# EAGLE design KeyboardWithArrows (EAGLE 9.3.1)
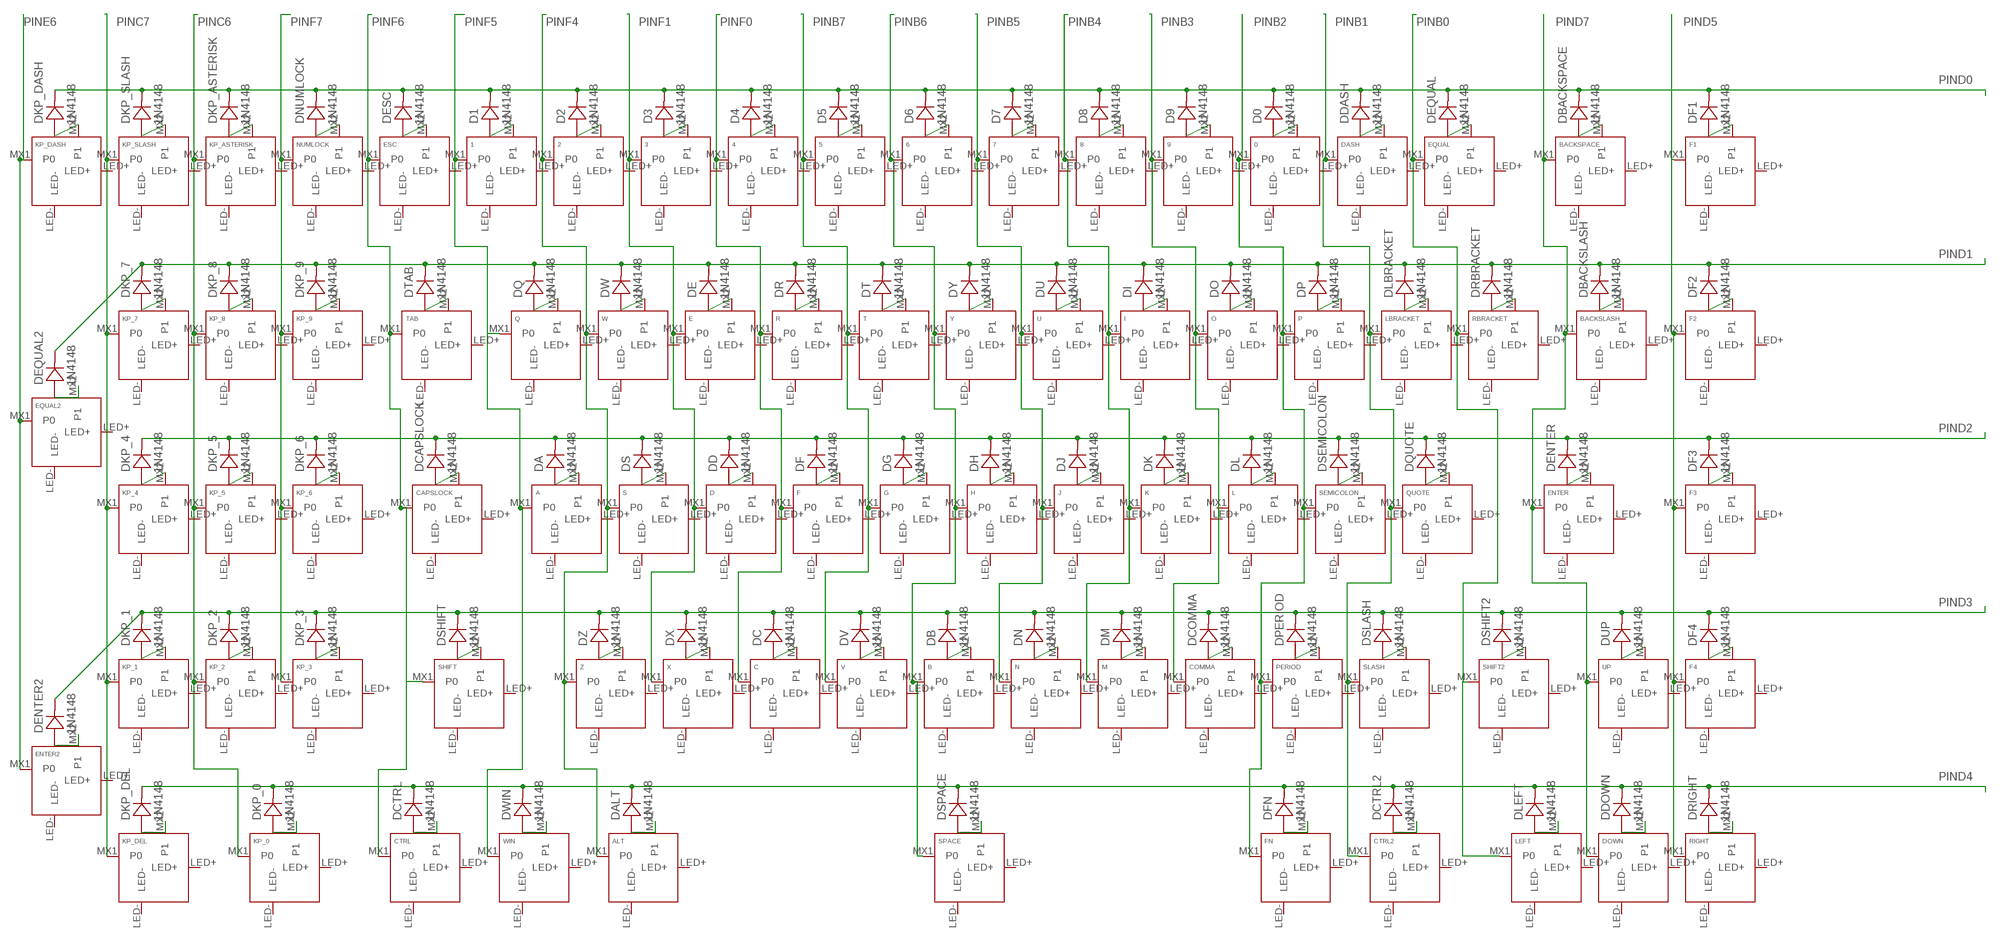
[diagram p0: schematic, sheet 1, part 1 of 2]
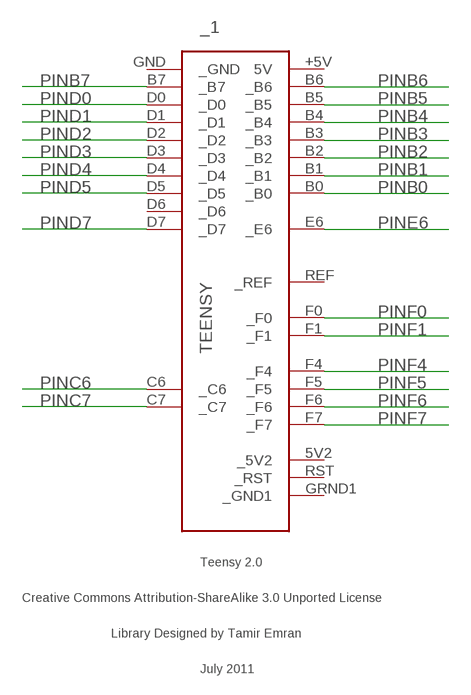
[diagram p1: schematic, sheet 1, part 2 of 2]

## Parts
0  KEYSWITCH-LED-MX-1U-LED  [MX-1U-LED]
1  KEYSWITCH-LED-MX-1U-LED  [MX-1U-LED]
2  KEYSWITCH-LED-MX-1U-LED  [MX-1U-LED]
3  KEYSWITCH-LED-MX-1U-LED  [MX-1U-LED]
4  KEYSWITCH-LED-MX-1U-LED  [MX-1U-LED]
5  KEYSWITCH-LED-MX-1U-LED  [MX-1U-LED]
6  KEYSWITCH-LED-MX-1U-LED  [MX-1U-LED]
7  KEYSWITCH-LED-MX-1U-LED  [MX-1U-LED]
8  KEYSWITCH-LED-MX-1U-LED  [MX-1U-LED]
9  KEYSWITCH-LED-MX-1U-LED  [MX-1U-LED]
_1  TEENSY  [TEENSY]
A  KEYSWITCH-LED-MX-1U-LED  [MX-1U-LED]
ALT  KEYSWITCH-LED-MX-1U-LED  [MX-1U-LED]
B  KEYSWITCH-LED-MX-1U-LED  [MX-1U-LED]
BACKSLASH  KEYSWITCH-LED-MX-1U-LED  [MX-1U-LED]
BACKSPACE  KEYSWITCH-LED-MX-2U-LED  [MX-2U-LED]
C  KEYSWITCH-LED-MX-1U-LED  [MX-1U-LED]
CAPSLOCK  KEYSWITCH-LED-MX-1U-LED  [MX-1U-LED]
COMMA  KEYSWITCH-LED-MX-1U-LED  [MX-1U-LED]
CTRL  KEYSWITCH-LED-MX-1U-LED  [MX-1U-LED]
CTRL2  KEYSWITCH-LED-MX-1U-LED  [MX-1U-LED]
D  KEYSWITCH-LED-MX-1U-LED  [MX-1U-LED]
D0  1N4148  DIODE-DO-35  [DO-35]
D1  1N4148  DIODE-DO-35  [DO-35]
D2  1N4148  DIODE-DO-35  [DO-35]
D3  1N4148  DIODE-DO-35  [DO-35]
D4  1N4148  DIODE-DO-35  [DO-35]
D5  1N4148  DIODE-DO-35  [DO-35]
D6  1N4148  DIODE-DO-35  [DO-35]
D7  1N4148  DIODE-DO-35  [DO-35]
D8  1N4148  DIODE-DO-35  [DO-35]
D9  1N4148  DIODE-DO-35  [DO-35]
DA  1N4148  DIODE-DO-35  [DO-35]
DALT  1N4148  DIODE-DO-35  [DO-35]
DASH  KEYSWITCH-LED-MX-1U-LED  [MX-1U-LED]
DB  1N4148  DIODE-DO-35  [DO-35]
DBACKSLASH  1N4148  DIODE-DO-35  [DO-35]
DBACKSPACE  1N4148  DIODE-DO-35  [DO-35]
DC  1N4148  DIODE-DO-35  [DO-35]
DCAPSLOCK  1N4148  DIODE-DO-35  [DO-35]
DCOMMA  1N4148  DIODE-DO-35  [DO-35]
DCTRL  1N4148  DIODE-DO-35  [DO-35]
DCTRL2  1N4148  DIODE-DO-35  [DO-35]
DD  1N4148  DIODE-DO-35  [DO-35]
DDASH  1N4148  DIODE-DO-35  [DO-35]
DDOWN  1N4148  DIODE-DO-35  [DO-35]
DE  1N4148  DIODE-DO-35  [DO-35]
DENTER  1N4148  DIODE-DO-35  [DO-35]
DENTER2  1N4148  DIODE-DO-35  [DO-35]
DEQUAL  1N4148  DIODE-DO-35  [DO-35]
DEQUAL2  1N4148  DIODE-DO-35  [DO-35]
DESC  1N4148  DIODE-DO-35  [DO-35]
DF  1N4148  DIODE-DO-35  [DO-35]
DF1  1N4148  DIODE-DO-35  [DO-35]
DF2  1N4148  DIODE-DO-35  [DO-35]
DF3  1N4148  DIODE-DO-35  [DO-35]
DF4  1N4148  DIODE-DO-35  [DO-35]
DFN  1N4148  DIODE-DO-35  [DO-35]
DG  1N4148  DIODE-DO-35  [DO-35]
DH  1N4148  DIODE-DO-35  [DO-35]
DI  1N4148  DIODE-DO-35  [DO-35]
DJ  1N4148  DIODE-DO-35  [DO-35]
DK  1N4148  DIODE-DO-35  [DO-35]
DKP_0  1N4148  DIODE-DO-35  [DO-35]
DKP_1  1N4148  DIODE-DO-35  [DO-35]
DKP_2  1N4148  DIODE-DO-35  [DO-35]
DKP_3  1N4148  DIODE-DO-35  [DO-35]
DKP_4  1N4148  DIODE-DO-35  [DO-35]
DKP_5  1N4148  DIODE-DO-35  [DO-35]
DKP_6  1N4148  DIODE-DO-35  [DO-35]
DKP_7  1N4148  DIODE-DO-35  [DO-35]
DKP_8  1N4148  DIODE-DO-35  [DO-35]
DKP_9  1N4148  DIODE-DO-35  [DO-35]
DKP_ASTERISK  1N4148  DIODE-DO-35  [DO-35]
DKP_DASH  1N4148  DIODE-DO-35  [DO-35]
DKP_DEL  1N4148  DIODE-DO-35  [DO-35]
DKP_SLASH  1N4148  DIODE-DO-35  [DO-35]
DL  1N4148  DIODE-DO-35  [DO-35]
DLBRACKET  1N4148  DIODE-DO-35  [DO-35]
DLEFT  1N4148  DIODE-DO-35  [DO-35]
DM  1N4148  DIODE-DO-35  [DO-35]
DN  1N4148  DIODE-DO-35  [DO-35]
DNUMLOCK  1N4148  DIODE-DO-35  [DO-35]
DO  1N4148  DIODE-DO-35  [DO-35]
DOWN  KEYSWITCH-LED-MX-1U-LED  [MX-1U-LED]
DP  1N4148  DIODE-DO-35  [DO-35]
DPERIOD  1N4148  DIODE-DO-35  [DO-35]
DQ  1N4148  DIODE-DO-35  [DO-35]
DQUOTE  1N4148  DIODE-DO-35  [DO-35]
DR  1N4148  DIODE-DO-35  [DO-35]
DRBRACKET  1N4148  DIODE-DO-35  [DO-35]
DRIGHT  1N4148  DIODE-DO-35  [DO-35]
DS  1N4148  DIODE-DO-35  [DO-35]
DSEMICOLON  1N4148  DIODE-DO-35  [DO-35]
DSHIFT  1N4148  DIODE-DO-35  [DO-35]
DSHIFT2  1N4148  DIODE-DO-35  [DO-35]
DSLASH  1N4148  DIODE-DO-35  [DO-35]
DSPACE  1N4148  DIODE-DO-35  [DO-35]
DT  1N4148  DIODE-DO-35  [DO-35]
DTAB  1N4148  DIODE-DO-35  [DO-35]
DU  1N4148  DIODE-DO-35  [DO-35]
DUP  1N4148  DIODE-DO-35  [DO-35]
DV  1N4148  DIODE-DO-35  [DO-35]
DW  1N4148  DIODE-DO-35  [DO-35]
DWIN  1N4148  DIODE-DO-35  [DO-35]
DX  1N4148  DIODE-DO-35  [DO-35]
DY  1N4148  DIODE-DO-35  [DO-35]
DZ  1N4148  DIODE-DO-35  [DO-35]
E  KEYSWITCH-LED-MX-1U-LED  [MX-1U-LED]
ENTER  KEYSWITCH-LED-MX-2U-LED  [MX-2U-LED]
ENTER2  KEYSWITCH-LED-MX-1U-LED  [MX-1U-LED]
EQUAL  KEYSWITCH-LED-MX-1U-LED  [MX-1U-LED]
EQUAL2  KEYSWITCH-LED-MX-1U-LED  [MX-1U-LED]
ESC  KEYSWITCH-LED-MX-1U-LED  [MX-1U-LED]
F  KEYSWITCH-LED-MX-1U-LED  [MX-1U-LED]
F1  KEYSWITCH-LED-MX-1U-LED  [MX-1U-LED]
F2  KEYSWITCH-LED-MX-1U-LED  [MX-1U-LED]
F3  KEYSWITCH-LED-MX-1U-LED  [MX-1U-LED]
F4  KEYSWITCH-LED-MX-1U-LED  [MX-1U-LED]
FN  KEYSWITCH-LED-MX-1U-LED  [MX-1U-LED]
G  KEYSWITCH-LED-MX-1U-LED  [MX-1U-LED]
H  KEYSWITCH-LED-MX-1U-LED  [MX-1U-LED]
I  KEYSWITCH-LED-MX-1U-LED  [MX-1U-LED]
J  KEYSWITCH-LED-MX-1U-LED  [MX-1U-LED]
K  KEYSWITCH-LED-MX-1U-LED  [MX-1U-LED]
KP_0  KEYSWITCH-LED-MX-2U-LED  [MX-2U-LED]
KP_1  KEYSWITCH-LED-MX-1U-LED  [MX-1U-LED]
KP_2  KEYSWITCH-LED-MX-1U-LED  [MX-1U-LED]
KP_3  KEYSWITCH-LED-MX-1U-LED  [MX-1U-LED]
KP_4  KEYSWITCH-LED-MX-1U-LED  [MX-1U-LED]
KP_5  KEYSWITCH-LED-MX-1U-LED  [MX-1U-LED]
KP_6  KEYSWITCH-LED-MX-1U-LED  [MX-1U-LED]
KP_7  KEYSWITCH-LED-MX-1U-LED  [MX-1U-LED]
KP_8  KEYSWITCH-LED-MX-1U-LED  [MX-1U-LED]
KP_9  KEYSWITCH-LED-MX-1U-LED  [MX-1U-LED]
KP_ASTERISK  KEYSWITCH-LED-MX-1U-LED  [MX-1U-LED]
KP_DASH  KEYSWITCH-LED-MX-1U-LED  [MX-1U-LED]
KP_DEL  KEYSWITCH-LED-MX-1U-LED  [MX-1U-LED]
KP_SLASH  KEYSWITCH-LED-MX-1U-LED  [MX-1U-LED]
L  KEYSWITCH-LED-MX-1U-LED  [MX-1U-LED]
LBRACKET  KEYSWITCH-LED-MX-1U-LED  [MX-1U-LED]
LEFT  KEYSWITCH-LED-MX-1U-LED  [MX-1U-LED]
M  KEYSWITCH-LED-MX-1U-LED  [MX-1U-LED]
N  KEYSWITCH-LED-MX-1U-LED  [MX-1U-LED]
NUMLOCK  KEYSWITCH-LED-MX-1U-LED  [MX-1U-LED]
O  KEYSWITCH-LED-MX-1U-LED  [MX-1U-LED]
P  KEYSWITCH-LED-MX-1U-LED  [MX-1U-LED]
PERIOD  KEYSWITCH-LED-MX-1U-LED  [MX-1U-LED]
Q  KEYSWITCH-LED-MX-1U-LED  [MX-1U-LED]
QUOTE  KEYSWITCH-LED-MX-1U-LED  [MX-1U-LED]
R  KEYSWITCH-LED-MX-1U-LED  [MX-1U-LED]
RBRACKET  KEYSWITCH-LED-MX-1U-LED  [MX-1U-LED]
RIGHT  KEYSWITCH-LED-MX-1U-LED  [MX-1U-LED]
S  KEYSWITCH-LED-MX-1U-LED  [MX-1U-LED]
SEMICOLON  KEYSWITCH-LED-MX-1U-LED  [MX-1U-LED]
SHIFT  KEYSWITCH-LED-MX-2U-LED  [MX-2U-LED]
SHIFT2  KEYSWITCH-LED-MX-1U-LED  [MX-1U-LED]
SLASH  KEYSWITCH-LED-MX-1U-LED  [MX-1U-LED]
SPACE  KEYSWITCH-LED-MX-6.25U-LED  [MX-6.25U-LED]
T  KEYSWITCH-LED-MX-1U-LED  [MX-1U-LED]
TAB  KEYSWITCH-LED-MX-1U-LED  [MX-1U-LED]
U  KEYSWITCH-LED-MX-1U-LED  [MX-1U-LED]
UP  KEYSWITCH-LED-MX-1U-LED  [MX-1U-LED]
V  KEYSWITCH-LED-MX-1U-LED  [MX-1U-LED]
W  KEYSWITCH-LED-MX-1U-LED  [MX-1U-LED]
WIN  KEYSWITCH-LED-MX-1U-LED  [MX-1U-LED]
X  KEYSWITCH-LED-MX-1U-LED  [MX-1U-LED]
Y  KEYSWITCH-LED-MX-1U-LED  [MX-1U-LED]
Z  KEYSWITCH-LED-MX-1U-LED  [MX-1U-LED]

## Nets
N$1: DKP_DASH.A KP_DASH.MX2(P1)
N$2: DKP_SLASH.A KP_SLASH.MX2(P1)
N$3: DKP_ASTERISK.A KP_ASTERISK.MX2(P1)
N$4: DNUMLOCK.A NUMLOCK.MX2(P1)
N$5: 1.MX2(P1) D1.A
N$6: DESC.A ESC.MX2(P1)
N$7: 2.MX2(P1) D2.A
N$8: 3.MX2(P1) D3.A
N$9: 4.MX2(P1) D4.A
N$10: 5.MX2(P1) D5.A
N$11: 6.MX2(P1) D6.A
N$12: 7.MX2(P1) D7.A
N$13: 8.MX2(P1) D8.A
N$14: 9.MX2(P1) D9.A
N$15: 0.MX2(P1) D0.A
N$16: DASH.MX2(P1) DDASH.A
N$17: DEQUAL.A EQUAL.MX2(P1)
N$18: BACKSPACE.MX2(P1) DBACKSPACE.A
N$19: DF1.A F1.MX2(P1)
N$20: DF2.A F2.MX2(P1)
N$21: BACKSLASH.MX2(P1) DBACKSLASH.A
N$22: DRBRACKET.A RBRACKET.MX2(P1)
N$23: DLBRACKET.A LBRACKET.MX2(P1)
N$24: DP.A P.MX2(P1)
N$25: DO.A O.MX2(P1)
N$26: DI.A I.MX2(P1)
N$27: DU.A U.MX2(P1)
N$28: DY.A Y.MX2(P1)
N$29: DT.A T.MX2(P1)
N$30: DR.A R.MX2(P1)
N$31: DE.A E.MX2(P1)
N$32: DW.A W.MX2(P1)
N$33: DQ.A Q.MX2(P1)
N$34: DTAB.A TAB.MX2(P1)
N$35: DKP_9.A KP_9.MX2(P1)
N$36: DKP_8.A KP_8.MX2(P1)
N$37: DKP_7.A KP_7.MX2(P1)
N$38: DKP_4.A KP_4.MX2(P1)
N$39: DKP_5.A KP_5.MX2(P1)
N$40: DKP_6.A KP_6.MX2(P1)
N$41: CAPSLOCK.MX2(P1) DCAPSLOCK.A
N$42: A.MX2(P1) DA.A
N$43: DS.A S.MX2(P1)
N$44: D.MX2(P1) DD.A
N$45: DF.A F.MX2(P1)
N$46: DG.A G.MX2(P1)
N$47: DH.A H.MX2(P1)
N$48: DJ.A J.MX2(P1)
N$49: DK.A K.MX2(P1)
N$50: DL.A L.MX2(P1)
N$51: DSEMICOLON.A SEMICOLON.MX2(P1)
N$52: DQUOTE.A QUOTE.MX2(P1)
N$53: DENTER.A ENTER.MX2(P1)
N$54: DF3.A F3.MX2(P1)
N$55: DF4.A F4.MX2(P1)
N$56: DUP.A UP.MX2(P1)
N$57: DSHIFT2.A SHIFT2.MX2(P1)
N$58: DSLASH.A SLASH.MX2(P1)
N$59: DPERIOD.A PERIOD.MX2(P1)
N$60: COMMA.MX2(P1) DCOMMA.A
N$61: DM.A M.MX2(P1)
N$62: DN.A N.MX2(P1)
N$63: B.MX2(P1) DB.A
N$64: DV.A V.MX2(P1)
N$65: C.MX2(P1) DC.A
N$66: DX.A X.MX2(P1)
N$67: DZ.A Z.MX2(P1)
N$68: DSHIFT.A SHIFT.MX2(P1)
N$69: DKP_3.A KP_3.MX2(P1)
N$70: DKP_2.A KP_2.MX2(P1)
N$71: DKP_1.A KP_1.MX2(P1)
N$72: DENTER2.A ENTER2.MX2(P1)
N$73: DKP_DEL.A KP_DEL.MX2(P1)
N$74: DKP_0.A KP_0.MX2(P1)
N$75: CTRL.MX2(P1) DCTRL.A
N$76: DWIN.A WIN.MX2(P1)
N$77: ALT.MX2(P1) DALT.A
N$78: DSPACE.A SPACE.MX2(P1)
N$79: DFN.A FN.MX2(P1)
N$80: CTRL2.MX2(P1) DCTRL2.A
N$81: DLEFT.A LEFT.MX2(P1)
N$82: DDOWN.A DOWN.MX2(P1)
N$83: DRIGHT.A RIGHT.MX2(P1)
N$84: DEQUAL2.A EQUAL2.MX2(P1)
PINB0: _1.B0(_B0) EQUAL.MX1(P0) LEFT.MX1(P0) RBRACKET.MX1(P0) SHIFT2.MX1(P0)
PINB1: _1.B1(_B1) CTRL2.MX1(P0) DASH.MX1(P0) LBRACKET.MX1(P0) QUOTE.MX1(P0) SLASH.MX1(P0)
PINB2: 0.MX1(P0) _1.B2(_B2) FN.MX1(P0) P.MX1(P0) PERIOD.MX1(P0) SEMICOLON.MX1(P0)
PINB3: 9.MX1(P0) _1.B3(_B3) COMMA.MX1(P0) L.MX1(P0) O.MX1(P0)
PINB4: 8.MX1(P0) _1.B4(_B4) I.MX1(P0) K.MX1(P0) M.MX1(P0)
PINB5: 7.MX1(P0) _1.B5(_B5) J.MX1(P0) N.MX1(P0) U.MX1(P0)
PINB6: 6.MX1(P0) _1.B6(_B6) B.MX1(P0) H.MX1(P0) SPACE.MX1(P0) Y.MX1(P0)
PINB7: 5.MX1(P0) _1.B7(_B7) G.MX1(P0) T.MX1(P0) V.MX1(P0)
PINC6: _1.C6(_C6) KP_0.MX1(P0) KP_2.MX1(P0) KP_5.MX1(P0) KP_8.MX1(P0) KP_ASTERISK.MX1(P0)
PINC7: _1.C7(_C7) KP_1.MX1(P0) KP_4.MX1(P0) KP_7.MX1(P0) KP_DEL.MX1(P0) KP_SLASH.MX1(P0)
PIND0: _1.D0(_D0) D0.C D1.C D2.C D3.C D4.C D5.C D6.C D7.C D8.C D9.C DBACKSPACE.C DDASH.C DEQUAL.C DESC.C DF1.C DKP_ASTERISK.C DKP_DASH.C DKP_SLASH.C DNUMLOCK.C
PIND1: _1.D1(_D1) DBACKSLASH.C DE.C DEQUAL2.C DF2.C DI.C DKP_7.C DKP_8.C DKP_9.C DLBRACKET.C DO.C DP.C DQ.C DR.C DRBRACKET.C DT.C DTAB.C DU.C DW.C DY.C
PIND2: _1.D2(_D2) DA.C DCAPSLOCK.C DD.C DENTER.C DF3.C DF.C DG.C DH.C DJ.C DK.C DKP_4.C DKP_5.C DKP_6.C DL.C DQUOTE.C DS.C DSEMICOLON.C
PIND3: _1.D3(_D3) DB.C DC.C DCOMMA.C DENTER2.C DF4.C DKP_1.C DKP_2.C DKP_3.C DM.C DN.C DPERIOD.C DSHIFT2.C DSHIFT.C DSLASH.C DUP.C DV.C DX.C DZ.C
PIND4: _1.D4(_D4) DALT.C DCTRL2.C DCTRL.C DDOWN.C DFN.C DKP_0.C DKP_DEL.C DLEFT.C DRIGHT.C DSPACE.C DWIN.C
PIND5: _1.D5(_D5) F1.MX1(P0) F2.MX1(P0) F3.MX1(P0) F4.MX1(P0) RIGHT.MX1(P0)
PIND7: _1.D7(_D7) BACKSLASH.MX1(P0) BACKSPACE.MX1(P0) DOWN.MX1(P0) ENTER.MX1(P0) UP.MX1(P0)
PINE6: _1.E6(_E6) ENTER2.MX1(P0) EQUAL2.MX1(P0) KP_DASH.MX1(P0)
PINF0: 4.MX1(P0) _1.F0(_F0) C.MX1(P0) F.MX1(P0) R.MX1(P0)
PINF1: 3.MX1(P0) _1.F1(_F1) D.MX1(P0) E.MX1(P0) X.MX1(P0)
PINF4: 2.MX1(P0) _1.F4(_F4) ALT.MX1(P0) S.MX1(P0) W.MX1(P0) Z.MX1(P0)
PINF5: 1.MX1(P0) _1.F5(_F5) A.MX1(P0) Q.MX1(P0) WIN.MX1(P0)
PINF6: _1.F6(_F6) CAPSLOCK.MX1(P0) CTRL.MX1(P0) ESC.MX1(P0) SHIFT.MX1(P0) TAB.MX1(P0)
PINF7: _1.F7(_F7) KP_3.MX1(P0) KP_6.MX1(P0) KP_9.MX1(P0) NUMLOCK.MX1(P0)
Unconnected: 0.LED+ 0.LED- 1.LED+ 1.LED- 2.LED+ 2.LED- 3.LED+ 3.LED- 4.LED+ 4.LED- 5.LED+ 5.LED- 6.LED+ 6.LED- 7.LED+ 7.LED- 8.LED+ 8.LED- 9.LED+ 9.LED- _1.5V2(_5V2) _1.+5V(5V) _1.D6(_D6) _1.GND(_GND) _1.GRND1(_GND1) _1.REF(_REF) _1.RST(_RST) A.LED+ A.LED- ALT.LED+ ALT.LED- B.LED+ B.LED- BACKSLASH.LED+ BACKSLASH.LED- BACKSPACE.LED+ BACKSPACE.LED- C.LED+ C.LED- CAPSLOCK.LED+ CAPSLOCK.LED- COMMA.LED+ COMMA.LED- CTRL2.LED+ CTRL2.LED- CTRL.LED+ CTRL.LED- D.LED+ D.LED- DASH.LED+ DASH.LED- DOWN.LED+ DOWN.LED- E.LED+ E.LED- ENTER2.LED+ ENTER2.LED- ENTER.LED+ ENTER.LED- EQUAL2.LED+ EQUAL2.LED- EQUAL.LED+ EQUAL.LED- ESC.LED+ ESC.LED- F1.LED+ F1.LED- F2.LED+ F2.LED- F3.LED+ F3.LED- F4.LED+ F4.LED- F.LED+ F.LED- FN.LED+ FN.LED- G.LED+ G.LED- H.LED+ H.LED- I.LED+ I.LED- J.LED+ J.LED- K.LED+ K.LED- KP_0.LED+ KP_0.LED- KP_1.LED+ KP_1.LED- KP_2.LED+ KP_2.LED- KP_3.LED+ KP_3.LED- KP_4.LED+ KP_4.LED- KP_5.LED+ KP_5.LED- KP_6.LED+ KP_6.LED- KP_7.LED+ KP_7.LED- KP_8.LED+ KP_8.LED- KP_9.LED+ KP_9.LED- KP_ASTERISK.LED+ KP_ASTERISK.LED- KP_DASH.LED+ KP_DASH.LED- KP_DEL.LED+ KP_DEL.LED- KP_SLASH.LED+ KP_SLASH.LED- L.LED+ L.LED- LBRACKET.LED+ LBRACKET.LED- LEFT.LED+ LEFT.LED- M.LED+ M.LED- N.LED+ N.LED- NUMLOCK.LED+ NUMLOCK.LED- O.LED+ O.LED- P.LED+ P.LED- PERIOD.LED+ PERIOD.LED- Q.LED+ Q.LED- QUOTE.LED+ QUOTE.LED- R.LED+ R.LED- RBRACKET.LED+ RBRACKET.LED- RIGHT.LED+ RIGHT.LED- S.LED+ S.LED- SEMICOLON.LED+ SEMICOLON.LED- SHIFT2.LED+ SHIFT2.LED- SHIFT.LED+ SHIFT.LED- SLASH.LED+ SLASH.LED- SPACE.LED+ SPACE.LED- T.LED+ T.LED- TAB.LED+ TAB.LED- U.LED+ U.LED- UP.LED+ UP.LED- V.LED+ V.LED- W.LED+ W.LED- WIN.LED+ WIN.LED- X.LED+ X.LED- Y.LED+ Y.LED- Z.LED+ Z.LED-

## Library data of the parts
0 1-9 A ALT B BACKSLASH BACKSPACE C CAPSLOCK COMMA CTRL CTRL2 D DASH DOWN E ENTER ENTER2 EQUAL EQUAL2 ESC F F1-F4 FN G H I J K KP_0 KP_1-KP_9 KP_ASTERISK KP_DASH KP_DEL KP_SLASH L LBRACKET LEFT M N NUMLOCK O P PERIOD Q QUOTE R RBRACKET RIGHT S SEMICOLON SHIFT SHIFT2 SLASH SPACE T TAB U UP V W WIN X Y Z = Keyboard:KEYSWITCH-LED
_1 = teensy:TEENSY: Teensy 2.0 Original Design by Clint Fisher Modified Design by Tamir Emran Licensed Under Creative Commons Attribution-ShareAlike 3.0 Unported (CC BY-SA 3.0)
D0 D1-D9 DA DALT DB DBACKSLASH DBACKSPACE DC DCAPSLOCK DCOMMA DCTRL DCTRL2 DD DDASH DDOWN DE DENTER DENTER2 DEQUAL DEQUAL2 DESC DF DF1-DF4 DFN DG DH DI DJ DK DKP_0 DKP_1-DKP_9 DKP_ASTERISK DKP_DASH DKP_DEL DKP_SLASH DL DLBRACKET DLEFT DM DN DNUMLOCK DO DP DPERIOD DQ DQUOTE DR DRBRACKET DRIGHT DS DSEMICOLON DSHIFT DSHIFT2 DSLASH DSPACE DT DTAB DU DUP DV DW DWIN DX DY DZ = Components:DIODE: Standard 1N4148 diode

## Board
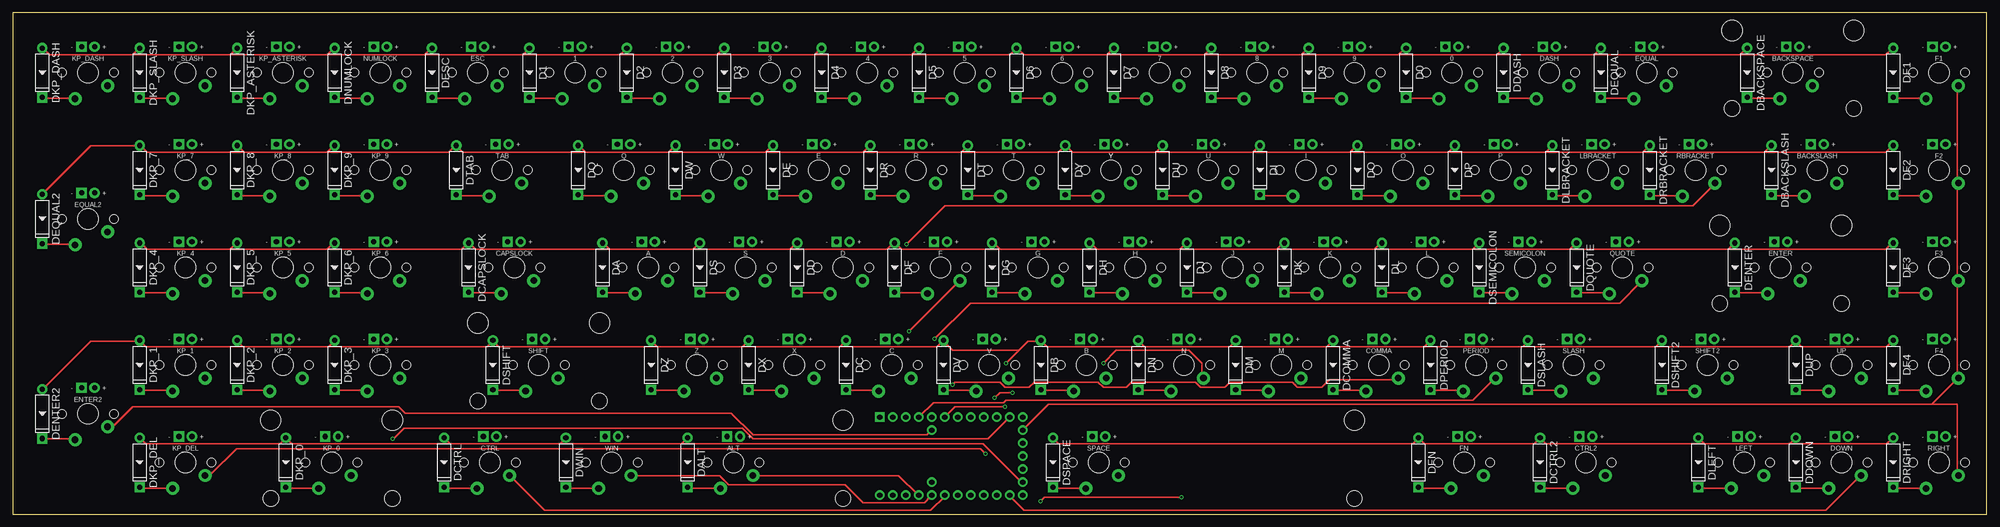
[diagram p2: board, top side]
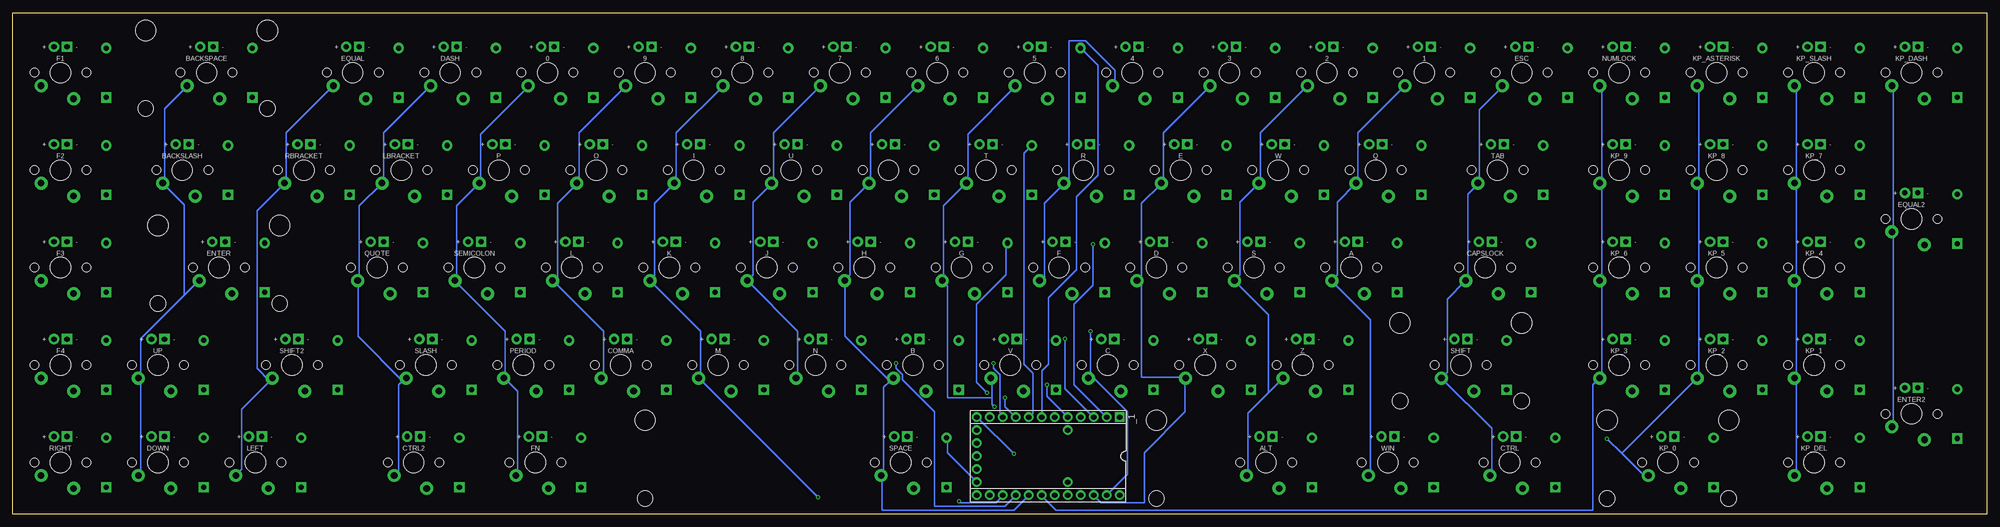
[diagram p3: board, bottom side, seen from below]

Size 386 x 98 mm. Coordinates in mm from the lower left corner, seen from the top.
Outline: 0,0 386,0 386,98 0,98 0,0
Copper layers (1*16): Top 0.035mm / dielectric 1.5mm / Bottom 0.035mm
Design rules "Standard": minimum track width 10mil, minimum drill 15mil, track to track 10mil, track to pad 10mil, pad to pad 10mil, via to via 10mil, smd to smd 10mil, copper to edge 20mil, drill to drill 10mil, minimum pad ring 8mil, minimum via ring 8mil, stop-mask expansion 4mil, vias tented up to drill 0mil, thermal gap 10mil

### Footprints (pad centres in the part's own frame; a part is rotated, then mirrored left to right if it is on the bottom)
MX-1U-LED = drill 1 pad 2: LED+ -1.27,-5.08 | drill 1 pad 2 square: LED- 1.27,-5.08 | drill 1.3 pad 2.54: MX1 -3.81,2.54; MX2 2.54,5.08 | hole 4: 0,0 | hole 1.7: -5.08,0; 5.08,0
TEENSY = drill 1.016 pad 1.88: 5V2 13.97,-2.54; +5V -13.97,7.62; B0 -11.43,-7.62; B1 -8.89,-7.62; B2 -6.35,-7.62; B3 -3.81,-7.62; B4 8.89,7.62; B5 6.35,7.62; B6 3.81,7.62; B7 -1.27,-7.62; C6 11.43,-7.62; C7 13.97,-7.62; D0 1.27,-7.62; D1 3.81,-7.62; D2 6.35,-7.62; D3 8.89,-7.62; D4 13.97,5.08; D5 13.97,-5.08; D6 13.97,7.62; D7 11.43,7.62; E6 -3.81,-5.08; F0 -11.43,7.62; F1 -8.89,7.62; F4 -6.35,7.62; F5 -3.81,7.62; F6 -1.27,7.62; F7 1.27,7.62; GRND1 13.97,0; REF -3.81,5.08; RST 13.97,2.54 | drill 1.016 pad 1.88 square: GND -13.97,-7.62
MX-2U-LED = drill 1 pad 2: LED+ -1.27,-5.08 | drill 1 pad 2 square: LED- 1.27,-5.08 | drill 1.3 pad 2.54: MX1 -3.81,2.54; MX2 2.54,5.08 | hole 4: 0,0; -11.9,-8.24; 11.9,-8.24 | hole 1.7: -5.08,0; 5.08,0 | hole 3.05: -11.9,7; 11.9,7
DO-35 = drill 1 pad 2 square: A 4.82,0 | drill 1 pad 2: C -4.82,0
MX-6.25U-LED = drill 1 pad 2: LED+ -1.27,-5.08 | drill 1 pad 2 square: LED- 1.27,-5.08 | drill 1.3 pad 2.54: MX1 -3.81,2.54; MX2 2.54,5.08 | hole 4: 0,0; -50,-8.24; 50,-8.24 | hole 1.7: -5.08,0; 5.08,0 | hole 3.05: -50,7; 50,7

### Placement (x,y rotation side)
0  281.42,86.28 180 top
1  109.97,86.28 180 top
2  129.02,86.28 180 top
3  148.07,86.28 180 top
4  167.12,86.28 180 top
5  186.17,86.28 180 top
6  205.22,86.28 180 top
7  224.27,86.28 180 top
8  243.32,86.28 180 top
9  262.37,86.28 180 top
_1  183.52,11.32 180 bottom
A  124.26,48.18 180 top
ALT  140.93,10.08 180 top
B  209.98,29.13 180 top
BACKSLASH  352.86,67.23 180 top
BACKSPACE  348.1,86.28 180 top
C  171.88,29.13 180 top
CAPSLOCK  98.06,48.18 180 top
COMMA  267.13,29.13 180 top
CTRL  93.3,10.08 180 top
CTRL2  307.61,10.08 180 top
D  162.36,48.18 180 top
D0  272.47,86.28 270 top
D1  101.02,86.28 270 top
D2  120.07,86.28 270 top
D3  139.12,86.28 270 top
D4  158.17,86.28 270 top
D5  177.22,86.28 270 top
D6  196.27,86.28 270 top
D7  215.32,86.28 270 top
D8  234.37,86.28 270 top
D9  253.42,86.28 270 top
DA  115.31,48.18 270 top
DALT  131.98,10.08 270 top
DASH  300.47,86.28 180 top
DB  201.03,29.13 270 top
DBACKSLASH  343.91,67.23 270 top
DBACKSPACE  339.15,86.28 270 top
DC  162.93,29.13 270 top
DCAPSLOCK  89.11,48.18 270 top
DCOMMA  258.18,29.13 270 top
DCTRL  84.35,10.08 270 top
DCTRL2  298.66,10.08 270 top
DD  153.41,48.18 270 top
DDASH  291.52,86.28 270 top
DDOWN  348.67,10.08 270 top
DE  148.65,67.23 270 top
DENTER  336.76,48.18 270 top
DENTER2  5.77,19.6 270 top
DEQUAL  310.57,86.28 270 top
DEQUAL2  5.77,57.7 270 top
DESC  81.97,86.28 270 top
DF  172.46,48.18 270 top
DF1  367.72,86.28 270 top
DF2  367.72,67.23 270 top
DF3  367.72,48.18 270 top
DF4  367.72,29.13 270 top
DFN  274.85,10.08 270 top
DG  191.51,48.18 270 top
DH  210.56,48.18 270 top
DI  243.9,67.23 270 top
DJ  229.61,48.18 270 top
DK  248.66,48.18 270 top
DKP_0  53.4,10.08 270 top
DKP_1  24.82,29.13 270 top
DKP_2  43.87,29.13 270 top
DKP_3  62.92,29.13 270 top
DKP_4  24.82,48.18 270 top
DKP_5  43.87,48.18 270 top
DKP_6  62.92,48.18 270 top
DKP_7  24.82,67.23 270 top
DKP_8  43.87,67.23 270 top
DKP_9  62.92,67.23 270 top
DKP_ASTERISK  43.87,86.28 270 top
DKP_DASH  5.77,86.28 270 top
DKP_DEL  24.82,10.08 270 top
DKP_SLASH  24.82,86.28 270 top
DL  267.71,48.18 270 top
DLBRACKET  301.05,67.23 270 top
DLEFT  329.62,10.08 270 top
DM  239.13,29.13 270 top
DN  220.08,29.13 270 top
DNUMLOCK  62.92,86.28 270 top
DO  262.95,67.23 270 top
DOWN  357.62,10.08 180 top
DP  282,67.23 270 top
DPERIOD  277.23,29.13 270 top
DQ  110.55,67.23 270 top
DQUOTE  305.81,48.18 270 top
DR  167.7,67.23 270 top
DRBRACKET  320.1,67.23 270 top
DRIGHT  367.72,10.08 270 top
DS  134.36,48.18 270 top
DSEMICOLON  286.76,48.18 270 top
DSHIFT  93.88,29.13 270 top
DSHIFT2  322.48,29.13 270 top
DSLASH  296.28,29.13 270 top
DSPACE  203.41,10.08 270 top
DT  186.75,67.23 270 top
DTAB  86.73,67.23 270 top
DU  224.85,67.23 270 top
DUP  348.67,29.13 270 top
DV  181.98,29.13 270 top
DW  129.6,67.23 270 top
DWIN  108.16,10.08 270 top
DX  143.88,29.13 270 top
DY  205.8,67.23 270 top
DZ  124.83,29.13 270 top
E  157.6,67.23 180 top
ENTER  345.71,48.18 180 top
ENTER2  14.72,19.6 180 top
EQUAL  319.52,86.28 180 top
EQUAL2  14.72,57.7 180 top
ESC  90.92,86.28 180 top
F  181.41,48.18 180 top
F1  376.67,86.28 180 top
F2  376.67,67.23 180 top
F3  376.67,48.18 180 top
F4  376.67,29.13 180 top
FN  283.8,10.08 180 top
G  200.46,48.18 180 top
H  219.51,48.18 180 top
I  252.85,67.23 180 top
J  238.56,48.18 180 top
K  257.61,48.18 180 top
KP_0  62.35,10.08 180 top
KP_1  33.77,29.13 180 top
KP_2  52.82,29.13 180 top
KP_3  71.87,29.13 180 top
KP_4  33.77,48.18 180 top
KP_5  52.82,48.18 180 top
KP_6  71.87,48.18 180 top
KP_7  33.77,67.23 180 top
KP_8  52.82,67.23 180 top
KP_9  71.87,67.23 180 top
KP_ASTERISK  52.82,86.28 180 top
KP_DASH  14.72,86.28 180 top
KP_DEL  33.77,10.08 180 top
KP_SLASH  33.77,86.28 180 top
L  276.66,48.18 180 top
LBRACKET  310,67.23 180 top
LEFT  338.57,10.08 180 top
M  248.08,29.13 180 top
N  229.03,29.13 180 top
NUMLOCK  71.87,86.28 180 top
O  271.9,67.23 180 top
P  290.95,67.23 180 top
PERIOD  286.18,29.13 180 top
Q  119.5,67.23 180 top
QUOTE  314.76,48.18 180 top
R  176.65,67.23 180 top
RBRACKET  329.05,67.23 180 top
RIGHT  376.67,10.08 180 top
S  143.31,48.18 180 top
SEMICOLON  295.71,48.18 180 top
SHIFT  102.83,29.13 180 top
SHIFT2  331.43,29.13 180 top
SLASH  305.23,29.13 180 top
SPACE  212.36,10.08 180 top
T  195.7,67.23 180 top
TAB  95.68,67.23 180 top
U  233.8,67.23 180 top
UP  357.62,29.13 180 top
V  190.93,29.13 180 top
W  138.55,67.23 180 top
WIN  117.11,10.08 180 top
X  152.83,29.13 180 top
Y  214.75,67.23 180 top
Z  133.78,29.13 180 top

### Tracks (layer width: path | path; a pad name or v marks a point on that pad's centre or on a via)
N$1
  Top 0.254: DKP_DASH.A 6,81.25 12,81.25 KP_DASH.MX2
N$2
  Top 0.254: DKP_SLASH.A 25,81.25 31,81.25 KP_SLASH.MX2
N$3
  Top 0.254: DKP_ASTERISK.A 44,81.25 50.25,81.25 KP_ASTERISK.MX2
N$4
  Top 0.254: DNUMLOCK.A 63,81.25 69.25,81.25 NUMLOCK.MX2
N$5
  Top 0.254: D1.A 101.25,81.25 107.25,81.25 1.MX2
N$6
  Top 0.254: DESC.A 82,81.25 88.25,81.25 ESC.MX2
N$7
  Top 0.254: D2.A 120.25,81.25 126.25,81.25 2.MX2
N$8
  Top 0.254: D3.A 139.25,81.25 145.5,81.25 3.MX2
N$9
  Top 0.254: D4.A 158.25,81.25 164.5,81.25 4.MX2
N$10
  Top 0.254: D5.A 177.25,81.25 183.5,81.25 5.MX2
N$11
  Top 0.254: D6.A 196.5,81.25 202.5,81.25 6.MX2
N$12
  Top 0.254: D7.A 215.5,81.25 221.5,81.25 7.MX2
N$13
  Top 0.254: D8.A 234.5,81.25 240.75,81.25 8.MX2
N$14
  Top 0.254: D9.A 253.5,81.25 259.75,81.25 9.MX2
N$15
  Top 0.254: D0.A 272.5,81.25 278.75,81.25 0.MX2
N$16
  Top 0.254: DDASH.A 291.75,81.25 297.75,81.25 DASH.MX2
N$17
  Top 0.254: DEQUAL.A 310.75,81.25 316.75,81.25 EQUAL.MX2
N$18
  Top 0.254: DBACKSPACE.A 339.25,81.25 345.5,81.25 BACKSPACE.MX2
N$19
  Top 0.254: DF1.A 367.75,81.25 374,81.25 F1.MX2
N$20
  Top 0.254: DF2.A 367.75,62.25 374,62.25 F2.MX2
N$21
  Top 0.254: DBACKSLASH.A 344,62.25 350.25,62.25 BACKSLASH.MX2
N$22
  Top 0.254: DRBRACKET.A 320.25,62.25 326.5,62.25 RBRACKET.MX2
N$23
  Top 0.254: DLBRACKET.A 301.25,62.25 307.25,62.25 LBRACKET.MX2
N$24
  Top 0.254: DP.A 282,62.25 288.25,62.25 P.MX2
N$25
  Top 0.254: DO.A 263,62.25 269.25,62.25 O.MX2
N$26
  Top 0.254: DI.A 244,62.25 250.25,62.25 I.MX2
N$27
  Top 0.254: DU.A 225,62.25 231.25,62.25 U.MX2
N$28
  Top 0.254: DY.A 206,62.25 212,62.25 Y.MX2
N$29
  Top 0.254: DT.A 186.75,62.25 193,62.25 T.MX2
N$30
  Top 0.254: DR.A 167.75,62.25 174,62.25 R.MX2
N$31
  Top 0.254: DE.A 148.75,62.25 155,62.25 E.MX2
N$32
  Top 0.254: DW.A 129.75,62.25 136,62.25 W.MX2
N$33
  Top 0.254: DQ.A 110.75,62.25 116.75,62.25 Q.MX2
N$34
  Top 0.254: DTAB.A 86.75,62.25 93,62.25 TAB.MX2
N$35
  Top 0.254: DKP_9.A 63,62.25 69.25,62.25 KP_9.MX2
N$36
  Top 0.254: DKP_8.A 44,62.25 50.25,62.25 KP_8.MX2
N$37
  Top 0.254: DKP_7.A 25,62.25 31,62.25 KP_7.MX2
N$38
  Top 0.254: DKP_4.A 25,43.25 31,43.25 KP_4.MX2
N$39
  Top 0.254: DKP_5.A 44,43.25 50.25,43.25 KP_5.MX2
N$40
  Top 0.254: DKP_6.A 63,43.25 69.25,43.25 KP_6.MX2
N$41
  Top 0.254: DCAPSLOCK.A 89.25,43.25 95.5,43.25 CAPSLOCK.MX2
N$42
  Top 0.254: DA.A 115.5,43.25 121.5,43.25 A.MX2
N$43
  Top 0.254: DS.A 134.5,43.25 140.75,43.25 S.MX2
N$44
  Top 0.254: DD.A 153.5,43.25 159.75,43.25 D.MX2
N$45
  Top 0.254: DF.A 172.5,43.25 178.75,43.25 F.MX2
N$46
  Top 0.254: DG.A 191.75,43.25 197.75,43.25 G.MX2
N$47
  Top 0.254: DH.A 210.75,43.25 216.75,43.25 H.MX2
N$48
  Top 0.254: DJ.A 229.75,43.25 236,43.25 J.MX2
N$49
  Top 0.254: DK.A 248.75,43.25 255,43.25 K.MX2
N$50
  Top 0.254: DL.A 267.75,43.25 274,43.25 L.MX2
N$51
  Top 0.254: DSEMICOLON.A 287,43.25 293,43.25 SEMICOLON.MX2
N$52
  Top 0.254: DQUOTE.A 306,43.25 312,43.25 QUOTE.MX2
N$53
  Top 0.254: DENTER.A 337,43.25 343,43.25 ENTER.MX2
N$54
  Top 0.254: DF3.A 367.75,43.25 374,43.25 F3.MX2
N$55
  Top 0.254: DF4.A 367.75,24.25 374,24.25 F4.MX2
N$56
  Top 0.254: DUP.A 348.75,24.25 355,24.25 UP.MX2
N$57
  Top 0.254: DSHIFT2.A 322.5,24.25 328.75,24.25 SHIFT2.MX2
N$58
  Top 0.254: DSLASH.A 296.5,24.25 302.5,24.25 SLASH.MX2
N$59
  Top 0.254: DPERIOD.A 277.25,24.25 283.5,24.25 PERIOD.MX2
N$60
  Top 0.254: DCOMMA.A 258.25,24.25 264.5,24.25 COMMA.MX2
N$61
  Top 0.254: DM.A 239.25,24.25 245.5,24.25 M.MX2
N$62
  Top 0.254: DN.A 220.25,24.25 226.25,24.25 N.MX2
N$63
  Top 0.254: DB.A 201.25,24.25 207.25,24.25 B.MX2
N$64
  Top 0.254: DV.A 182,24.25 188.25,24.25 V.MX2
N$65
  Top 0.254: DC.A 163,24.25 169.25,24.25 C.MX2
N$66
  Top 0.254: DX.A 144,24.25 150.25,24.25 X.MX2
N$67
  Top 0.254: DZ.A 125,24.25 131,24.25 Z.MX2
N$68
  Top 0.254: DSHIFT.A 94,24.25 100.25,24.25 SHIFT.MX2
N$69
  Top 0.254: DKP_3.A 63,24.25 69.25,24.25 KP_3.MX2
N$70
  Top 0.254: DKP_2.A 44,24.25 50.25,24.25 KP_2.MX2
N$71
  Top 0.254: DKP_1.A 25,24.25 31,24.25 KP_1.MX2
N$72
  Top 0.254: DENTER2.A 6,14.75 12,14.75 ENTER2.MX2
N$73
  Top 0.254: KP_DEL.MX2 25.25,5 25,5.25 DKP_DEL.A
N$74
  Top 0.254: KP_0.MX2 53.75,5 53.5,5.25 DKP_0.A
N$75
  Top 0.254: CTRL.MX2 84.75,5 84.5,5.25 DCTRL.A
N$76
  Top 0.254: WIN.MX2 108.5,5 108.25,5.25 DWIN.A
N$77
  Top 0.254: ALT.MX2 132.25,5 132,5.25 DALT.A
N$78
  Top 0.254: SPACE.MX2 203.75,5 203.5,5.25 DSPACE.A
N$79
  Top 0.254: FN.MX2 275.25,5 275,5.25 DFN.A
N$80
  Top 0.254: CTRL2.MX2 299,5 298.75,5.25 DCTRL2.A
N$81
  Top 0.254: LEFT.MX2 330,5 329.75,5.25 DLEFT.A
N$82
  Top 0.254: DOWN.MX2 349,5 348.75,5.25 DDOWN.A
N$83
  Top 0.254: RIGHT.MX2 368,5 367.75,5.25 DRIGHT.A
N$84
  Top 0.254: DEQUAL2.A 6,52.75 12,52.75 EQUAL2.MX2
PINB0  (via drill 0.38)
  Top 0.254: v174.75,52.75 182.25,60.25 328.5,60.25 332.75,64.5 RBRACKET.MX1
  Bottom 0.254: 335.75,26 335.25,26.5 SHIFT2.MX1 335.75,26 | 335.75,26 341.25,20.5 341.25,8.75 342.25,7.75 LEFT.MX1 | v174.75,52.75 174.75,44.75 178.5,41 178.5,25.25 172.25,19 _1.B0 | EQUAL.MX1 323.5,83.5 332.5,74.5 332.5,65 332.75,64.75 RBRACKET.MX1 333,64.5 338.25,59.25 338.25,28.5 335.75,26
PINB1  (via drill 0.38)
  Top 0.254: v180.25,34.25 187.25,41.25 314.25,41.25 318.5,45.5 QUOTE.MX1
  Bottom 0.254: 309.75,26 309.25,26.5 SLASH.MX1 309.75,26 | 309.75,26 310.5,25.25 310.5,8.5 311.25,7.75 CTRL2.MX1 | v180.25,34.25 180.25,24.5 174.75,19 _1.B1 | DASH.MX1 304.5,83.5 313.5,74.5 313.5,65 LBRACKET.MX1 318.25,60.25 318.25,46 318.5,45.75 QUOTE.MX1 318.5,45.5 318.5,34.75 309.75,26
PINB2
  Top 0.254: _1.B2 177.25,19 180,21.75 193.75,21.75 194.25,22.25 285.5,22.25 289.75,26.5 PERIOD.MX1
  Bottom 0.254: FN.MX1 287.5,7.75 287.25,8 287.25,24 289.75,26.5 PERIOD.MX1 289.75,26.75 289.75,35.75 299.25,45.25 | 299.25,45.25 299.5,45.5 SEMICOLON.MX1 299.25,45.25 | 299.25,45.25 299.25,60.25 295,64.5 P.MX1 294.75,64.75 294.5,65 294.5,74.25 285.25,83.5 0.MX1
PINB3  (via drill 0.38)
  Top 0.254: v183.75,25.25 184.25,25.75 193,25.75 194,24.75 198.75,24.75 199.75,25.75 212.25,25.75 213.25,24.75 217.75,24.75 218.75,25.75 231.25,25.75 232.25,24.75 237,24.75 238,25.75 250.25,25.75 251.25,24.75 256,24.75 257.5,26.25 270.5,26.25 270.75,26.5 COMMA.MX1
  Bottom 0.254: 9.MX1 266.25,83.5 275.25,74.5 275.25,65 275.5,64.75 O.MX1 275.75,64.5 279.5,60.75 279.5,46.5 280.25,45.75 L.MX1 280.25,45.5 270.5,35.75 270.5,27 270.75,26.75 COMMA.MX1 | v183.75,25.25 183.75,23 179.75,19 _1.B3
PINB4  (via drill 0.38)
  Top 0.254: v201,2.5 201.75,3.25 v228.5,3.25
  Bottom 0.254: 8.MX1 247.25,83.5 256.25,74.5 256.25,65 256.5,64.75 I.MX1 256.75,64.5 260.5,60.75 260.5,46.5 261.25,45.75 K.MX1 261.25,45.5 251.5,35.75 251.5,26.25 | v201,2.5 201,2.25 193.75,2.25 192.5,3.5 _1.B4 | 251.5,26.25 251.75,26.5 M.MX1 251.5,26.25 | 251.5,26.25 v228.5,3.25
PINB5  (via drill 0.38)
  Top 0.254: v213.25,29.5 215.75,32 230,32 232.5,29.5 232.5,26.75 232.75,26.75 N.MX1
  Bottom 0.254: 7.MX1 228.25,83.5 237.25,74.5 237.25,65 237.5,64.75 U.MX1 237.75,64.5 241.25,61 241.25,46.75 242.25,45.75 J.MX1 242.25,45.5 232.5,35.75 232.5,27 232.75,26.75 N.MX1 | v213.25,29.5 213.25,28.5 212,27.25 212,26.25 205.75,20 205.75,1.5 192,1.5 190,3.5 _1.B5
PINB6
  Bottom 0.254: _1.B6 187.5,3.5 190.25,0.75 216,0.75 216,7.5 SPACE.MX1 216,7.75 215.75,8 215.75,24.75 214.5,26 | 214.5,26 214,26.5 B.MX1 214.5,26 | 6.MX1 209.25,83.5 218.25,74.5 218.25,65 Y.MX1 222.25,61 222.25,46.75 223.25,45.75 H.MX1 223.25,45.5 223.25,34.75 214.5,26
PINB7  (via drill 0.38)
  Top 0.254: v194,21 184.25,21 182.25,19 _1.B7
  Bottom 0.254: v194,21 194.5,21.5 194.5,22.75 | 194.5,22.75 194.5,26.5 V.MX1 | 5.MX1 190,83.5 199.25,74.25 199.25,65 199.5,64.75 T.MX1 199.75,64.5 204,60.25 204,46 204.25,45.75 G.MX1 204.25,45.5 203.25,44.5 203.25,22.75 194.5,22.75
PINC6  (via drill 0.38)
  Top 0.254: v74.25,14.75 74.5,14.75 76.5,16.75 142.75,16.75 144.75,14.75 190.75,14.75 194.75,18.75 _1.C6
  Bottom 0.254: 56.25,64.25 56.25,46 56.5,45.75 KP_5.MX1 56.5,45.5 56.25,45.25 56.25,27 56.5,26.75 KP_2.MX1 56.75,26.5 71.25,12 71.25,11.75 | 56.25,64.25 56.5,64.5 KP_8.MX1 56.25,64.25 | 56.25,64.25 56.25,83.25 56.5,83.5 KP_ASTERISK.MX1 | 71.25,11.75 67.25,7.75 66.25,7.75 KP_0.MX1 | 71.25,11.75 v74.25,14.75
PINC7  (via drill 0.38)
  Top 0.254: v190.25,11.75 189.25,12.75 43.75,12.75 38.75,7.75 37.75,7.75 KP_DEL.MX1
  Bottom 0.254: 37.25,45.25 37.25,27 37.5,26.75 KP_1.MX1 37.5,26.5 37.25,26.25 37.25,8 37.5,7.75 KP_DEL.MX1 | 37.25,45.25 37.5,45.5 KP_4.MX1 37.25,45.25 | 37.25,64.25 37.5,64.5 KP_7.MX1 37.25,64.25 | 37.25,45.25 37.25,64.25 | 37.25,64.25 37.25,83.25 37.5,83.5 KP_SLASH.MX1 | v190.25,11.75 197.25,18.75 _1.C7
PIND0
  Top 0.254: 214,89.75 197.75,89.75 196.5,91 D6.C 196.25,91 195,89.75 175.75,89.75 | 214,89.75 215.25,91 D7.C | 233,89.75 234.25,91 D8.C | 214,89.75 233,89.75 | 252,89.75 253.25,91 D9.C | 233,89.75 252,89.75 | 271,89.75 272.25,91 D0.C | 252,89.75 271,89.75 | 290.25,89.75 291.5,91 DDASH.C | 271,89.75 290.25,89.75 | 309.25,89.75 310.5,91 DEQUAL.C | 290.25,89.75 309.25,89.75 | 337.75,89.75 339,91 DBACKSPACE.C | 309.25,89.75 337.75,89.75 | 337.75,89.75 366.25,89.75 367.5,91 DF1.C | 23.5,89.75 7.25,89.75 6,91 DKP_DASH.C | 23.5,89.75 24.75,91 DKP_SLASH.C | 42.5,89.75 43.75,91 DKP_ASTERISK.C | 23.5,89.75 42.5,89.75 | 61.5,89.75 62.75,91 DNUMLOCK.C | 42.5,89.75 61.5,89.75 | 80.5,89.75 81.75,91 DESC.C | 61.5,89.75 80.5,89.75 | 99.75,89.75 101,91 D1.C | 80.5,89.75 99.75,89.75 | 118.75,89.75 120,91 D2.C | 99.75,89.75 118.75,89.75 | 137.75,89.75 139,91 D3.C | 118.75,89.75 137.75,89.75 | 156.75,89.75 158,91 D4.C | 137.75,89.75 156.75,89.75 | 175.75,89.75 177,91 D5.C | 156.75,89.75 175.75,89.75
  Bottom 0.254: _1.D0 184.75,19 184.75,28 183.5,29.25 183.5,42.25 178,47.75 178,62 173.75,66.25 173.75,87.75 177,91 D5.C
PIND1
  Top 0.254: 223.5,70.75 207.25,70.75 206,72 DY.C 204.5,70.75 185.5,70.75 | 223.5,70.75 224.75,72 DU.C | 242.5,70.75 243.75,72 DI.C | 223.5,70.75 242.5,70.75 | 261.5,70.75 262.75,72 DO.C | 242.5,70.75 261.5,70.75 | 280.75,70.75 282,72 DP.C | 261.5,70.75 280.75,70.75 | 299.75,70.75 DLBRACKET.C | 280.75,70.75 299.75,70.75 | 318.75,70.75 320,72 DRBRACKET.C | 299.75,70.75 318.75,70.75 | 342.5,70.75 343.75,72 DBACKSLASH.C | 318.75,70.75 342.5,70.75 | 342.5,70.75 366.25,70.75 367.5,72 DF2.C | DEQUAL2.C 15.25,72 24.75,72 DKP_7.C 25,72 26.25,70.75 45.25,70.75 | 45.25,70.75 44,72 DKP_8.C | 61.5,70.75 45.25,70.75 | 61.5,70.75 62.75,72 DKP_9.C | 61.5,70.75 85.25,70.75 86.5,72 DTAB.C 86.75,72 88,70.75 112,70.75 | 112,70.75 110.75,72 DQ.C | 128.25,70.75 112,70.75 | 128.25,70.75 129.5,72 DW.C | 147.25,70.75 148.5,72 DE.C | 128.25,70.75 147.25,70.75 | 166.25,70.75 167.5,72 DR.C | 147.25,70.75 166.25,70.75 | 185.5,70.75 186.75,72 DT.C | 166.25,70.75 185.5,70.75
  Bottom 0.254: _1.D1 187.25,19 186.5,19.75 186.5,27.5 188.25,29.25 188.25,70.5 186.75,72 DT.C
PIND2  (via drill 0.38)
  Top 0.254: 42.5,51.75 26.25,51.75 25,53 DKP_4.C | 42.5,51.75 43.75,53 DKP_5.C | 61.5,51.75 62.75,53 DKP_6.C | 42.5,51.75 61.5,51.75 | 61.5,51.75 87.75,51.75 89,53 DCAPSLOCK.C 89.25,53 90.5,51.75 116.75,51.75 | 116.75,51.75 115.5,53 DA.C | 133,51.75 116.75,51.75 | 133,51.75 134.25,53 DS.C | 152,51.75 153.25,53 DD.C | 133,51.75 152,51.75 | 152,51.75 171,51.75 172.25,53 DF.C 172.5,53 173.75,51.75 193,51.75 | v192,22.75 193,23.75 v195.5,23.75 | 212,51.75 210.75,53 DH.C | 228.25,51.75 212,51.75 | 228.25,51.75 229.5,53 DJ.C | 247.25,51.75 248.5,53 DK.C | 228.25,51.75 247.25,51.75 | 266.25,51.75 267.5,53 DL.C | 247.25,51.75 266.25,51.75 | 285.5,51.75 DSEMICOLON.C | 266.25,51.75 285.5,51.75 | 304.5,51.75 305.75,53 DQUOTE.C | 285.5,51.75 304.5,51.75 | 335.5,51.75 DENTER.C | 304.5,51.75 335.5,51.75 | 335.5,51.75 366.25,51.75 367.5,53 DF3.C | 193,51.75 191.75,53 DG.C | 212,51.75 193,51.75
  Bottom 0.254: v192,22.75 192,21 190,19 _1.D2 | v195.5,23.75 197.5,25.75 197.5,41 191.75,46.75 191.75,53 DG.C
PIND3  (via drill 0.38)
  Top 0.254: DENTER2.C 6,24.5 15.25,33.75 24.75,33.75 DKP_1.C 25,33.75 26,32.75 45,32.75 | 45,32.75 44,33.75 DKP_2.C | 61.75,32.75 45,32.75 | 61.75,32.75 62.75,33.75 DKP_3.C | 61.75,32.75 92.75,32.75 93.75,33.75 DSHIFT.C 94,33.75 95,32.75 126,32.75 | 196.75,32 198.5,33.75 201,33.75 DB.C 201.25,33.75 202.25,32.75 221.25,32.75 | 196.75,32 v194.25,29.5 | 196.75,32 183.75,32 182,33.75 DV.C 181.75,33.75 180.75,32.75 161.75,32.75 | 126,32.75 125,33.75 DZ.C | 142.75,32.75 126,32.75 | 142.75,32.75 143.75,33.75 DX.C | 161.75,32.75 162.75,33.75 DC.C | 142.75,32.75 161.75,32.75 | DF4.C 367.5,33.75 366.5,32.75 349.75,32.75 348.75,33.75 DUP.C 348.5,33.75 347.5,32.75 321.25,32.75 | 221.25,32.75 220.25,33.75 DN.C | 238,32.75 221.25,32.75 | 238,32.75 239,33.75 DM.C | 257,32.75 258,33.75 DCOMMA.C | 238,32.75 257,32.75 | 276,32.75 277,33.75 DPERIOD.C | 257,32.75 276,32.75 | 295.25,32.75 296.25,33.75 DSLASH.C | 276,32.75 295.25,32.75 | 321.25,32.75 322.25,33.75 DSHIFT2.C | 295.25,32.75 321.25,32.75
  Bottom 0.254: v194.25,29.5 194.25,28.5 193,27.25 193,19.5 192.5,19 _1.D3
PIND4
  Top 0.254: 330.75,13.75 329.75,14.75 DLEFT.C | 347.5,13.75 330.75,13.75 | 347.5,13.75 348.5,14.75 DDOWN.C | 347.5,13.75 366.5,13.75 367.5,14.75 DRIGHT.C | 330.75,13.75 299.75,13.75 298.75,14.75 DCTRL2.C 298.5,14.75 297.5,13.75 276,13.75 DFN.C 274.75,14.75 273.75,13.75 204.5,13.75 203.5,14.75 DSPACE.C | DKP_DEL.C 25,14.75 26,13.75 52.25,13.75 DKP_0.C 53.5,14.75 54.5,13.75 85.5,13.75 | 85.5,13.75 DCTRL.C | 107,13.75 85.5,13.75 | 107,13.75 108,14.75 DWIN.C | 130.75,13.75 131.75,14.75 DALT.C | 107,13.75 130.75,13.75 | 130.75,13.75 189.75,13.75 197.25,6.25 _1.D4
  Bottom 0.254: _1.D4 203.25,12 203.25,14.75 DSPACE.C
PIND5
  Top 0.254: F1.MX1 380.25,83.5 380.25,64.75 F2.MX1 380.25,64.5 380.25,45.75 F3.MX1 380.25,45.5 380.25,26.75 F4.MX1 380.25,26.5 375.25,21.5 | 375.25,21.5 202.5,21.5 197.5,16.5 _1.D5 | 375.25,21.5 380.25,21.5 380.25,7.75 RIGHT.MX1
PIND7
  Top 0.254: _1.D7 195,3.5 197.75,0.75 354.5,0.75 361.25,7.5 DOWN.MX1
  Bottom 0.254: 361,26.25 361.25,26.5 UP.MX1 361,26.25 | 361,26.25 361,8 361.25,7.75 DOWN.MX1 | 352.5,42.75 361,34.25 361,26.25 | 352.5,42.75 349.75,45.5 ENTER.MX1 | 356.25,64.25 352.5,60.5 352.5,42.75 | 356.25,64.25 356.5,64.5 BACKSLASH.MX1 356.25,64.25 | 356.25,64.25 356.25,79.25 352,83.5 BACKSPACE.MX1
PINE6
  Top 0.254: _1.E6 179.5,16.25 178.75,15.5 144.75,15.5 140.5,19.75 76.75,19.75 75.5,21 23.5,21 19.75,17.25 18.75,17.25 ENTER2.MX1
  Bottom 0.254: KP_DASH.MX1 18.5,83.5 18.25,83.25 18.25,55.5 18.5,55.25 EQUAL2.MX1 18.5,55 18.25,54.75 18.25,17.5 18.5,17.25 ENTER2.MX1
PINF0  (via drill 0.38)
  Top 0.254: v175.25,35.75 185,45.5 F.MX1
  Bottom 0.254: _1.F0 172,3.75 168,7.75 168,20 174.5,26.5 175.5,26.5 C.MX1 175.5,26.75 175.25,27 v175.25,35.75 | 4.MX1 170.75,83.75 170.5,84 170.5,86.75 176.25,92.5 179.5,92.5 179.5,65.5 180.25,64.75 R.MX1 180.5,64.5 184.25,60.75 184.25,46.5 185,45.75 F.MX1
PINF1
  Bottom 0.254: _1.F1 174.5,3.5 173.25,2.25 164.75,2.25 164.75,12 156.75,20 156.75,26.5 X.MX1 156.75,26.75 165.25,26.75 165.25,46.5 | 165.25,46.5 166,45.75 D.MX1 165.25,46.5 | 165.25,46.5 165.25,60.75 161.5,64.5 E.MX1 161.25,64.75 161,65 161,74.5 152,83.5 3.MX1
PINF4
  Top 0.254: _1.F4 177,3.75 173.25,7.5 144.75,7.5 ALT.MX1
  Bottom 0.254: 2.MX1 133,83.5 142,74.5 142,65 142.25,64.75 W.MX1 142.5,64.5 146,61 146,46.75 147,45.75 S.MX1 147,45.5 140.5,39 140.5,23.75 | 140.5,23.75 144.5,19.75 144.5,7.75 ALT.MX1 | 140.5,23.75 137.75,26.5 Z.MX1
PINF5
  Top 0.254: _1.F5 179.5,3.5 178.25,2.25 166.25,2.25 162.75,5.75 140,5.75 138.25,7.5 121,7.5 WIN.MX1
  Bottom 0.254: 1.MX1 114,83.5 123,74.5 123,65 Q.MX1 127,61 127,46.75 128,45.75 A.MX1 128,45.5 120.5,38 120.5,8 120.75,7.75 WIN.MX1
PINF6
  Top 0.254: _1.F6 182.25,3.5 179.5,0.75 104,0.75 97.25,7.5 CTRL.MX1
  Bottom 0.254: ESC.MX1 94.75,83.5 99.25,79 99.25,64.75 TAB.MX1 99.5,64.5 101.5,62.5 101.5,46 101.75,45.75 CAPSLOCK.MX1 102,45.5 105.5,42 105.5,27.75 106.5,26.75 SHIFT.MX1 106.5,26.5 96.75,16.75 96.75,8 97,7.75 CTRL.MX1
PINF7
  Bottom 0.254: 75.25,64.25 75.25,46 75.5,45.75 KP_6.MX1 75.5,45.5 75.25,45.25 75.25,27 75.5,26.75 KP_3.MX1 75.75,26.5 77,25.25 77,0.75 182,0.75 184.75,3.5 _1.F7 | 75.25,64.25 75.5,64.5 KP_9.MX1 75.25,64.25 | 75.25,64.25 75.25,83.25 75.5,83.5 NUMLOCK.MX1